# Altium project TAUV-Acoustic.PrjPcb
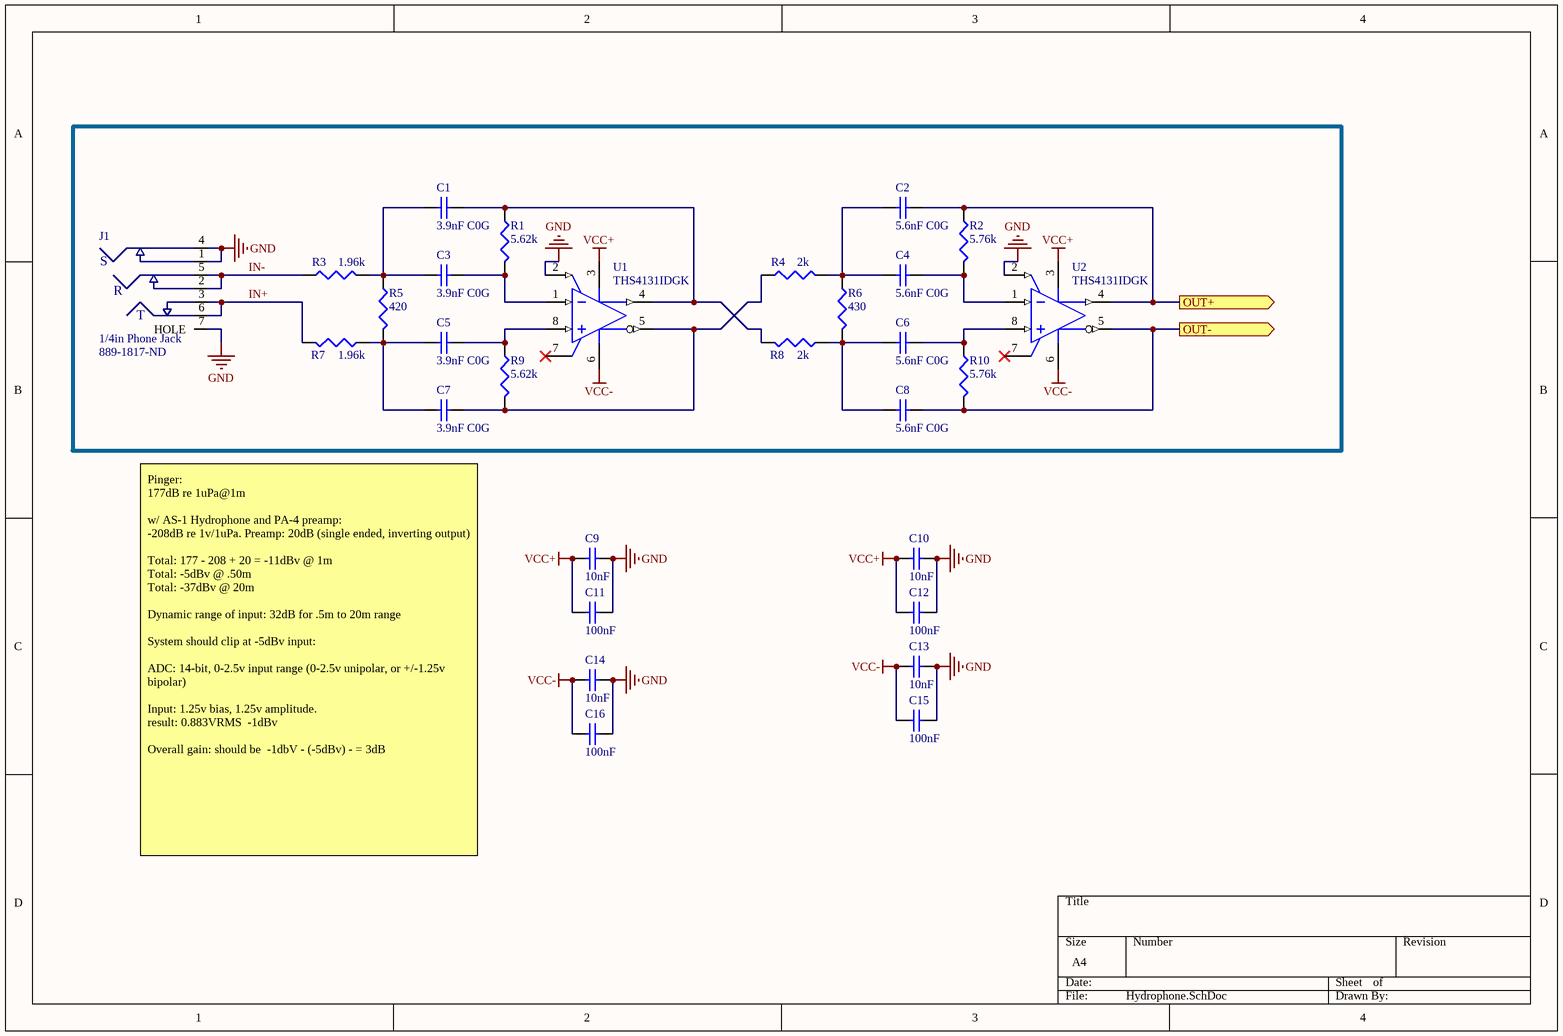
[diagram p0: Hydrophone.SchDoc]
2 sheets, 30 parts. Net scope: flat (ports and power ports of the same name join across sheets).
Board file: tauv-acoustic.PcbDoc
Sheets:
  Hydrophone.SchDoc
  adc.SchDoc

## Sheet Hydrophone.SchDoc
size A4

### Parts
C1  3.9nF C0G  [CAPC0603(1608)100_M]
C2  5.6nF C0G  [CAPC0603(1608)100_M]
C3  3.9nF C0G  [CAPC0603(1608)100_M]
C4  5.6nF C0G  [CAPC0603(1608)100_M]
C5  3.9nF C0G  [CAPC0603(1608)100_M]
C6  5.6nF C0G  [CAPC0603(1608)100_M]
C7  3.9nF C0G  [CAPC0603(1608)100_M]
C8  5.6nF C0G  [CAPC0603(1608)100_M]
C9  10nF  [CAPC0603(1608)100_M]
C10  10nF  [CAPC0603(1608)100_M]
C11  100nF  [CAPC0603(1608)100_M]
C12  100nF  [CAPC0603(1608)100_M]
C13  10nF  [CAPC0603(1608)100_M]
C14  10nF  [CAPC0603(1608)100_M]
C15  100nF  [CAPC0603(1608)100_M]
C16  100nF  [CAPC0603(1608)100_M]
J1  1/4in Phone Jack  Supplier Part Number 1: 889-1817-ND  [ACJS-MHDR]
R1  value 5.62k  [J1-0603]  (hidden comment: Res3)
R2  value 5.76k  [J1-0603]  (hidden comment: Res3)
R3  value 1.96k  [J1-0603]  (hidden comment: Res3)
R4  value 2k  [J1-0603]  (hidden comment: Res3)
R5  value 420  [J1-0603]  (hidden comment: Res3)
R6  value 430  [J1-0603]  (hidden comment: Res3)
R7  value 1.96k  [J1-0603]  (hidden comment: Res3)
R8  value 2k  [J1-0603]  (hidden comment: Res3)
R9  value 5.62k  [J1-0603]  (hidden comment: Res3)
R10  value 5.76k  [J1-0603]  (hidden comment: Res3)
U1  THS4131IDGK  [DGK0008A_N]
U2  THS4131IDGK  [DGK0008A_N]

### Ports
OUT+ (out), OUT- (out)

### Nets
GND: C9.2 C10.2 C11.2 C12.2 C13.2 C14.2 C15.2 C16.2 J1.1 J1.4 J1.7(HOLE) U1.2(VOCM) U2.2(VOCM)
VCC+: C9.1 C10.1 C11.1 C12.1 U1.3(VCC+) U2.3(VCC+)
VCC-: C13.1 C14.1 C15.1 C16.1 U1.6(VCC-) U2.6(VCC-)
IN+: J1.3 J1.6 R7.2
IN-: J1.2 J1.5 R3.1
NetC1_1: C1.1 C3.1 R3.2 R5.1
NetC1_2: C1.2 R1.1 R8.2 U1.4(VOUT+)
NetC2_1: C2.1 C4.1 R4.2 R6.1
NetC2_2: C2.2 R2.1 U2.4(VOUT+) ; port OUT+
NetC3_2: C3.2 R1.2 U1.1(VIN-)
NetC4_2: C4.2 R2.2 U2.1(VIN-)
NetC5_1: C5.1 C7.1 R5.2 R7.1
NetC5_2: C5.2 R9.1 U1.8(VIN+)
NetC6_1: C6.1 C8.1 R6.2 R8.1
NetC6_2: C6.2 R10.1 U2.8(VIN+)
NetC7_2: C7.2 R4.1 R9.2 U1.5(VOUT-)
NetC8_2: C8.2 R10.2 U2.5(VOUT-) ; port OUT-

Not connected (* = marked no-connect by the designer): U1 7(NC)*; U2 7(NC)*

### Notes on the sheet
- Pinger:
  177dB re 1uPa@1m
  w/ AS-1 Hydrophone and PA-4 preamp:
  -208dB re 1v/1uPa. Preamp: 20dB (single ended, inverting output)
  Total: 177 - 208 + 20 = -11dBv @ 1m
  Total: -5dBv @ .50m
  Total: -37dBv @ 20m
  Dynamic range of input: 32dB for .5m to 20m range
  System should clip at -5dBv input:
  ADC: 14-bit, 0-2.5v input range (0-2.5v unipolar, or +/-1.25v bipolar)
  Input: 1.25v bias, 1.25v amplitude.
  result: 0.883VRMS  -1dBv
  Overall gain: should be  -1dbV - (-5dBv) - = 3dB
- (in symbol ACJS-MHDR) S; R; T

### Library data of the parts
C1 C3 C5 C7 = CMP-1035-02165-1: CAP 3.9nF 50V ±20% 0603 (1608 Metric) Thickness 1mm SMD; Tolerance: Â±20%; Case-Metric: 1608; Case-EIA: 0603; Max Thickness: 1 mm; Technology: SMT; Value: 3.9nF; Rated Voltage: 50 V
C2 C4 C6 C8 = CMP-1035-02236-1: CAP 5.6nF 50V ±10% 0603 (1608 Metric) Thickness 1mm SMD; Tolerance: Â±10%; Case-EIA: 0603; Case-Metric: 1608; Technology: SMT; Max Thickness: 1 mm; Rated Voltage: 50 V; Value: 5.6nF
C9 C10 C13 C14 = CMP-1035-02321-1: CAP 10nF 50V ±10% 0603 (1608 Metric) Thickness 1mm SMD; Case-EIA: 0603; Case-Metric: 1608; Tolerance: Â±10%; Max Thickness: 1 mm; Rated Voltage: 50 V; Technology: SMT; Value: 10nF
C11 C12 C15 C16 = CMP-1035-02593-1: CAP 100nF 50V ±20% 0603 (1608 Metric) Thickness 1mm SMD; Tolerance: Â±20%; Case-EIA: 0603; Case-Metric: 1608; Max Thickness: 1 mm; Value: 100nF; Technology: SMT; Rated Voltage: 50 V
J1 = ACJS-MHDR: Supplier 1: Digi-Key
R1-R10 = Res3: Resistor; Published: 8-Jun-2000; LatestRevisionDate: 29-May-2009; LatestRevisionNote: IPC-7351 Footprint Added.; PackageReference: J1-0603; Publisher: Altium Limited; PackageDescription: Chip Resistor
U1 U2 = CMP-0811-00093-2: Fully Differential Input / Output Low Noise Amplifier, 5 to 30 V, -40 to 85 degC, 8-pin SOP (DGK8), Green (RoHS & no Sb/Br); Manufacturer: Texas Instruments; 2nd Harmonic(dBc): 88; Vn at Flatband(Typ)(nV/rtHz): 1.3; Vs(Min)(V): 5; Slew Rate(Typ)(V/us): 52; BW @ Acl(MHz): 150; Vio(Max)(mV): 2; SubFamily: Fully Differential Amplifier; Vs(Max)(V): 30; Number of Channels: 1; Settling Time (0.1%)(Typ)(ns): 78; THD (Fc is 1 MHz)(Typ)(dB): -80; 3rd Harmonic(dBc): 82; Io(Typ)(mA): 85; Offset Voltage Drift (+/-)(Max)(uV/Degrees Celsius: 4.5; Iq per channel(Max)(mA): 16; ComponentLink2Description: Datasheet; PackageVersion: 4073329/E, 05/2006; PartNumber: THS4131IDGK; ComponentLink1URL: http://www.ti.com/; DatasheetVersion: SLOS318H; Mounting Technology: Surface Mount; Code_JEDEC: MO-187; ComponentLink2URL: http://www.ti.com/general/docs/lit/getliterature.tsp?genericPartNumber=THS4131&fileType=pdf; PackageReference: DGK0008A; PackageDescription: 8-Pin Thin Small Outline, Body 3 x 3 mm, Pitch 0.65 mm; ComponentLink3Description: Package Specification; Eco-Plan: Green (RoHS & no Sb/Br); ComponentLink3URL: http://www.ti.com/litv/pdf/mpds028d; @ MHz: 1; ComponentLink1Description: Manufacturer URL

## Sheet adc.SchDoc
size A4
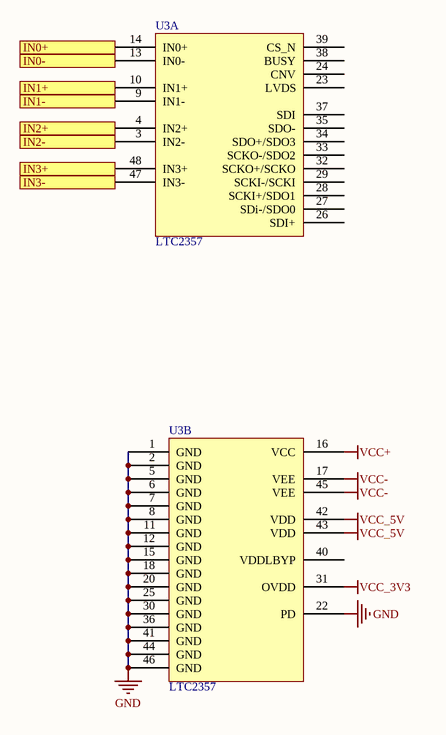
[diagram p1: adc.SchDoc]

### Parts
U3  LTC2357  [LTC2357]  (parts A,B of 2)

### Ports
IN0+ (in), IN0- (in), IN1+ (in), IN1- (in), IN2+ (in), IN2- (in), IN3+ (in), IN3- (in)

### Nets
GND: U3.1(GND) U3.2(GND) U3.5(GND) U3.6(GND) U3.7(GND) U3.8(GND) U3.11(GND) U3.12(GND) U3.15(GND) U3.18(GND) U3.20(GND) U3.22(PD) U3.25(GND) U3.30(GND) U3.36(GND) U3.41(GND) U3.44(GND) U3.46(GND)
VCC+: U3.16(VCC)
VCC-: U3.17(VEE) U3.45(VEE)
VCC_3V3: U3.31(OVDD)
VCC_5V: U3.42(VDD) U3.43(VDD)
NetU3_3: U3.3(IN2-) ; port IN2-
NetU3_4: U3.4(IN2+) ; port IN2+
NetU3_9: U3.9(IN1-) ; port IN1-
NetU3_10: U3.10(IN1+) ; port IN1+
NetU3_13: U3.13(IN0-) ; port IN0-
NetU3_14: U3.14(IN0+) ; port IN0+
NetU3_47: U3.47(IN3-) ; port IN3-
NetU3_48: U3.48(IN3+) ; port IN3+

Not connected (* = marked no-connect by the designer): U3 23(LVDS) 24(CNV) 26(SDI+) 27(SDi-/SDO0) 28(SCKI+/SDO1) 29(SCKI-/SCKI) 32(SCKO+/SCKO) 33(SCKO-/SDO2) 34(SDO+/SDO3) 35(SDO-) 37(SDI) 38(BUSY) 39(CS_N) 40(VDDLBYP)

### Library data of the parts
U3 = LTC2357: Supplier 1: Digi-Key

## Nets that join several sheets
GND: Hydrophone (13 pins), adc (18 pins)
VCC+: Hydrophone (6 pins), adc (U3.16)
VCC-: Hydrophone (6 pins), adc (U3.17 U3.45)